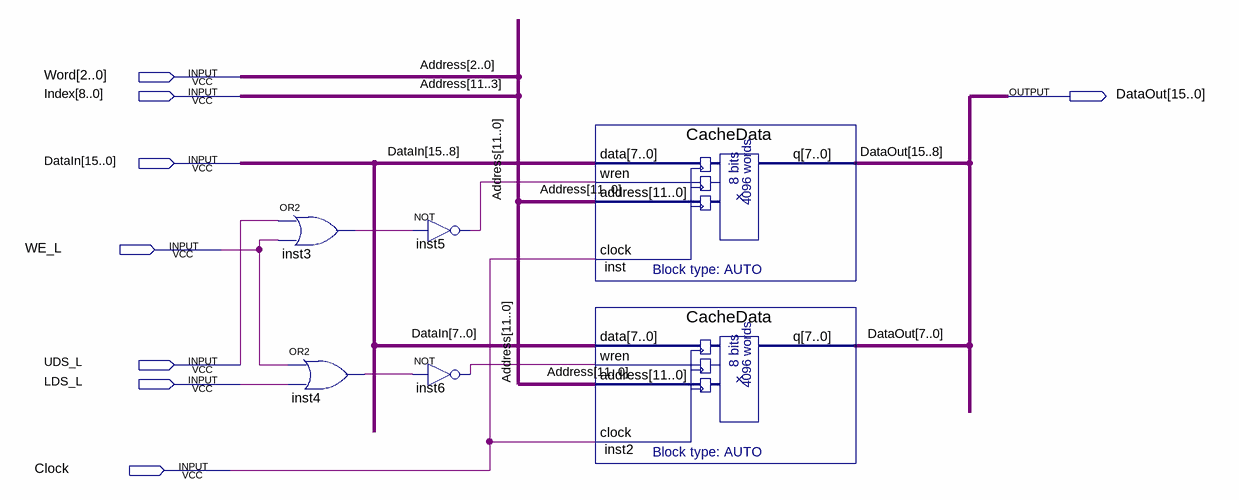
[diagram p0: schematic sheet]
// Quartus schematic CacheDataMemory.bdf as structural Verilog: 6 symbols, 8 pins
module CacheDataMemory (
  input  [2:0] Word,
  input  [8:0] Index,
  input  [15:0] DataIn,
  input  WE_L,
  input  UDS_L,
  input  LDS_L,
  input  Clock,
  output [15:0] DataOut
);

  wire inst3_out, inst4_out, inst5_out, inst6_out;

  or inst3 (inst3_out, UDS_L, WE_L);
  or inst4 (inst4_out, WE_L, LDS_L);
  not inst5 (inst5_out, inst3_out);
  not inst6 (inst6_out, inst4_out);
  CacheData inst (.data(DataIn[15:8]), .wren(inst5_out), .address({Index, Word}), .clock(Clock), .q(DataOut[15:8]));
  CacheData inst2 (.data(DataIn[7:0]), .wren(inst6_out), .address({Index, Word}), .clock(Clock), .q(DataOut[7:0]));

  // Other names for the same wires on the sheet: Address[11:0] = {Index, Word}
endmodule
